# Altium schematic sheet digital-encoder.SchDoc: Absolute Serial Encoder + Incremental
size A3; SheetNumber: 8; SheetTotal: 18
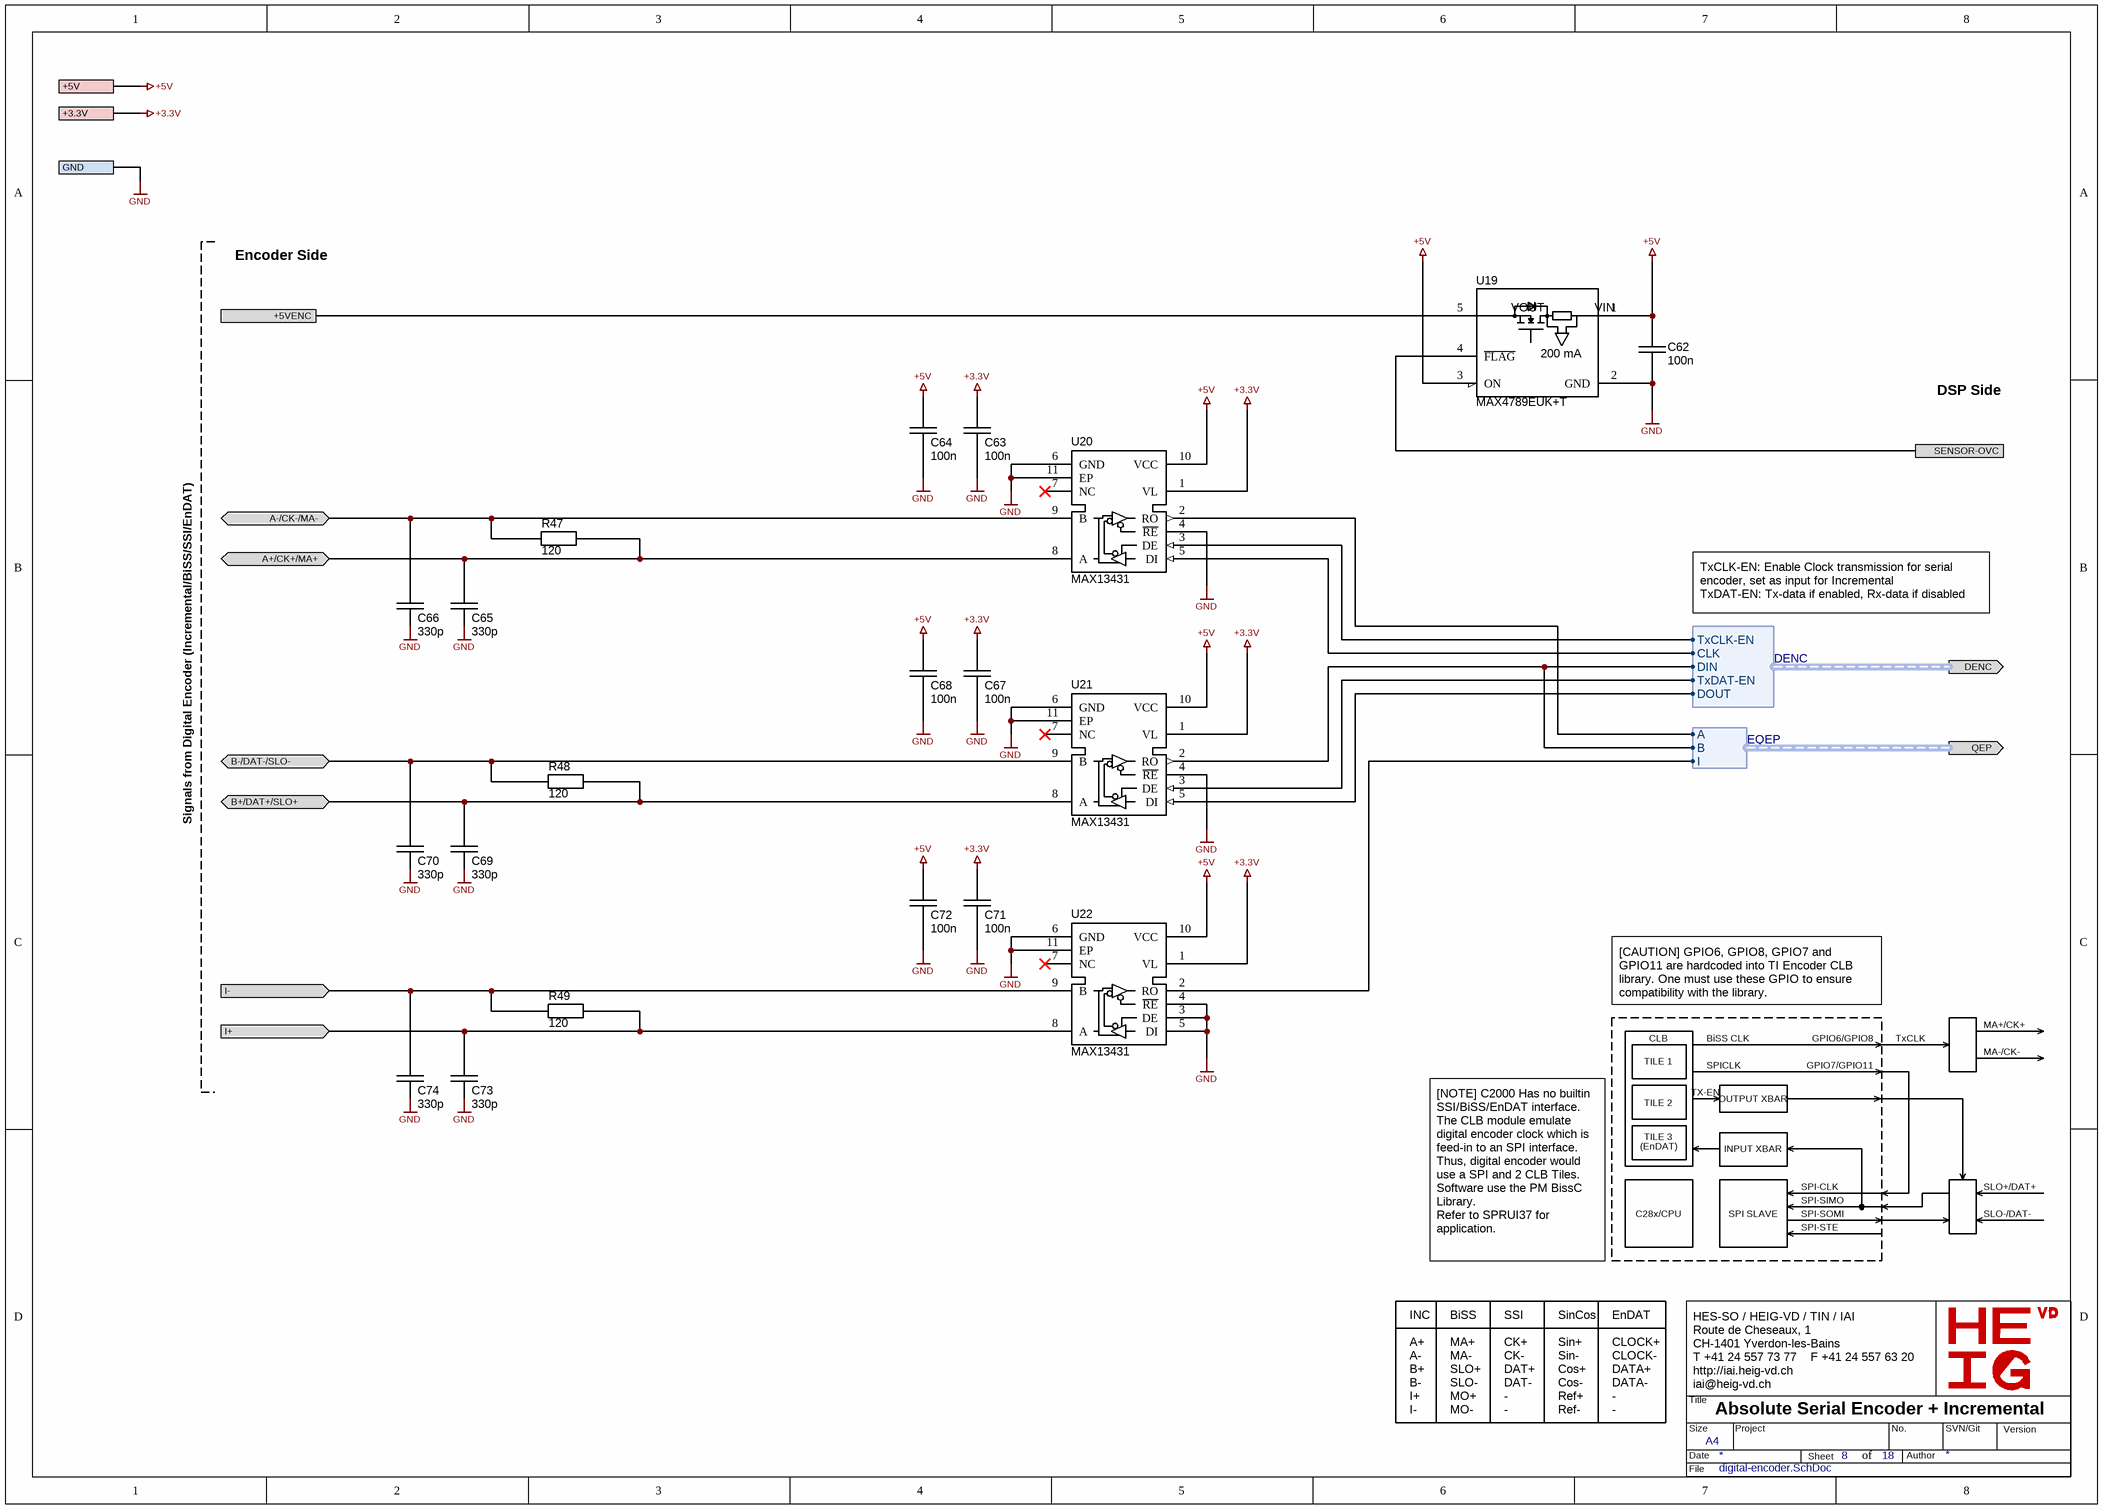
[diagram p0: digital-encoder.SchDoc]

## Parts
C62  100n  [SM/C0402]
C63  100n  [SM/C0402]
C64  100n  [SM/C0402]
C65  330p  [SM/C0402]
C66  330p  [SM/C0402]
C67  100n  [SM/C0402]
C68  100n  [SM/C0402]
C69  330p  [SM/C0402]
C70  330p  [SM/C0402]
C71  100n  [SM/C0402]
C72  100n  [SM/C0402]
C73  330p  [SM/C0402]
C74  330p  [SM/C0402]
R47  120  [SM/R0402]
R48  120  [SM/R0402]
R49  120  [SM/R0402]
U19  MAX4789EUK+T  [SOT23-5]
U20  MAX13431  [DFN10_3x3MC_MCH-M]
U21  MAX13431  [DFN10_3x3MC_MCH-M]
U22  MAX13431  [DFN10_3x3MC_MCH-M]

## Ports
+3.3V, +5V, +5VENC, A+/CK+/MA+ (bidir), A-/CK-/MA- (bidir), B+/DAT+/SLO+ (bidir), B-/DAT-/SLO- (bidir), DENC (out, harness DENC), GND, I+ (in), I- (in), QEP (out, harness EQEP), SENSOR-OVC

## Harnesses
EQEP: A, B, I
DENC: CLK, DIN, DOUT, TxCLK-EN, TxDAT-EN

## Nets
+3.3V: C63.2 C67.2 C71.2 U20.1(VL) U21.1(VL) U22.1(VL) ; port +3.3V
+5V: C62.1 C64.2 C68.2 C72.2 U19.1(VIN) U19.3(ON) U20.10(VCC) U21.10(VCC) U22.10(VCC) ; port +5V
GND: C62.2 C63.1 C64.1 C65.2 C66.2 C67.1 C68.1 C69.2 C70.2 C71.1 C72.1 C73.2 C74.2 U19.2(GND) U20.4(~{RE}) U20.6(GND) U20.11(EP) U21.4(~{RE}) U21.6(GND) U21.11(EP) U22.3(DE) U22.4(~{RE}) U22.5(DI) U22.6(GND) U22.11(EP) ; port GND
+5VENC: U19.5(VOUT) ; port +5VENC
A+/CK+/MA+: C65.1 R47.1 U20.8(A) ; port A+/CK+/MA+
A-/CK-/MA-: C66.1 R47.2 U20.9(B) ; port A-/CK-/MA-
B+/DAT+/SLO+: C69.1 R48.1 U21.8(A) ; port B+/DAT+/SLO+
B-/DAT-/SLO-: C70.1 R48.2 U21.9(B) ; port B-/DAT-/SLO-
I+: C73.1 R49.1 U22.8(A) ; port I+
I-: C74.1 R49.2 U22.9(B) ; port I-
SENSOR-OVC: U19.4(~{FLAG}) ; port SENSOR-OVC
NetU20_2: U20.2(RO) ; port QEP.A
NetU20_3: U20.3(DE) ; port DENC.TxCLK-EN
NetU20_5: U20.5(DI) ; port DENC.CLK
NetU21_2: U21.2(RO) ; port QEP.B, port DENC.DIN
NetU21_3: U21.3(DE) ; port DENC.TxDAT-EN
NetU21_5: U21.5(DI) ; port DENC.DOUT
NetU22_2: U22.2(RO) ; port QEP.I

Not connected (* = marked no-connect by the designer): U20 7(NC)*; U21 7(NC)*; U22 7(NC)*

## Notes on the sheet
- Encoder Side
- DSP Side
- Signals from Digital Encoder (Incremental/BiSS/SSI/EnDAT)
- TxCLK-EN: Enable Clock transmission for serial encoder, set as input for Incremental
  TxDAT-EN: Tx-data if enabled, Rx-data if disabled
- [CAUTION] GPIO6, GPIO8, GPIO7 and GPIO11 are hardcoded into TI Encoder CLB library. One must use these GPIO to ensure compatibility with the library.
- CLB
- TILE 1
- BiSS CLK
- GPIO6/GPIO8
- TxCLK
- MA+/CK+
- MA-/CK-
- TILE 2
- SPICLK
- TX-EN
- OUTPUT XBAR
- GPIO7/GPIO11
- TILE 3
- (EnDAT)
- INPUT XBAR
- SPI-CLK
- SLO+/DAT+
- [NOTE] C2000 Has no builtin SSI/BiSS/EnDAT interface. The CLB module emulate digital encoder clock which is feed-in to an SPI interface. Thus, digital encoder would use a SPI and 2 CLB Tiles.
  Software use the PM BissC Library.
  Refer to SPRUI37 for application.
- C28x/CPU
- SPI SLAVE
- SPI-SIMO
- SPI-SOMI
- SPI-STE
- SLO-/DAT-
- INC
- BiSS
- SSI
- SinCos
- EnDAT
- A+
- A-
- B+
- B-
- I+
- MA+
- MA-
- SLO+
- SLO-
- MO+
- CK+
- CK-
- DAT+
- DAT-
- -
- Sin+
- Sin-
- Cos+
- Cos-
- Ref+
- CLOCK+
- CLOCK-
- DATA+
- DATA-
- I-
- MO-
- Ref-
- HES-SO / HEIG-VD / TIN / IAI
  Route de Cheseaux, 1
  CH-1401 Yverdon-les-Bains
  T +41 24 557 73 77    F +41 24 557 63 20
  http://iai.heig-vd.ch
  iai@heig-vd.ch
- Title
- Size
- Date
- A4
- Project
- Sheet
- of
- No.
- Author
- SVN/Git
- Version
- File
- (in symbol MAX4789) 200 mA

## Library data of the parts
C62-C64 C67 C68 C71 C72 = CAP CER 100NF 25V X5R 0402: 100 nF ±10% 25V Ceramic Capacitor X5R 0402 (1005 Metric); Voltage: 25V; Dielectric: X5R; Supplier 1: Digi-Key; Supplier Part Number 1: 1276-1043-1-ND; Value: 100n
C65 C66 C69 C70 C73 C74 = CAP CER 330PF 50V C0G/NP0 0402: 330 pF ±5% 50V Ceramic Capacitor C0G, NP0 0402 (1005 Metric); Dielectric: NPO; Voltage: 50V; Supplier 1: Digi-Key; Supplier Part Number 1: 490-4928-1-ND; Value: 330p
R47-R49 = RES 120 OHM 1% 1/16W 0402: 120 Ohms ±1% 0.063W, 1/16W Chip Resistor 0402 (1005 Metric) Moisture Resistant Thick Film; Supplier 1: Digi-Key; Supplier Part Number 1: 311-120LRCT-ND; Value: 120
U19 = MAX4789: Current Limiting Regulator 200mA SOT-23-5; Voltage: 2.3..5.5V; Supplier 1: Digi-Key; Supplier Part Number 1: MAX4789EUK+TCT-ND
U20-U22 = MAX13431: 1/1 Transceiver Half RS422, RS485 10-TDFN (3x3); Supplier 1: Digi-Key; Supplier Part Number 1: MAX13431EETB+TCT-ND